# Altium schematic sheet ir_array.SchDoc
size A4; SheetNumber: 4; SheetTotal: 8
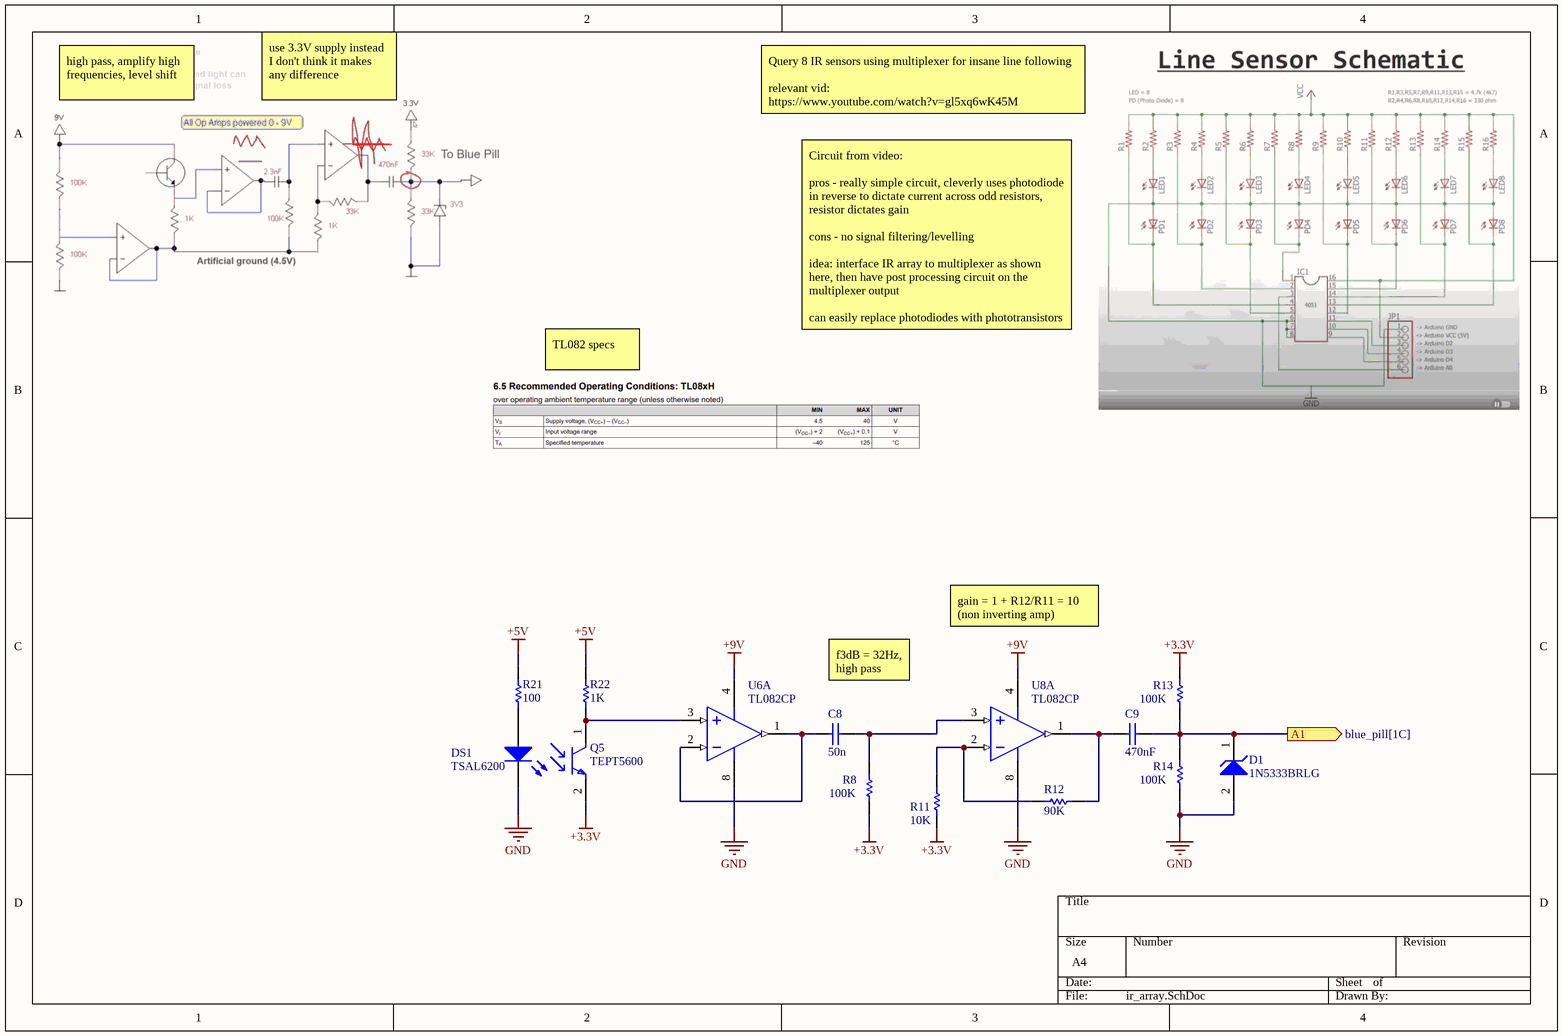
[diagram p0: ir_array.SchDoc]

## Parts
C8  value 50n  (hidden comment: Capacitor)
C9  value 470nF  (hidden comment: Capacitor)
D1  1N5333BRLG  [ONSC-SURMETIC40-2-017AA-01]
DS1  TSAL6200  [VISH-TSAL6200]
Q5  TEPT5600  [FP-6_544-5185_03-4-MFG]
R8  value 100K  (hidden comment: Resistor)
R11  value 10K  (hidden comment: Resistor)
R12  value 90K  (hidden comment: Resistor)
R13  value 100K  (hidden comment: Resistor)
R14  value 100K  (hidden comment: Resistor)
R21  value 100  (hidden comment: Resistor)
R22  value 1K  (hidden comment: Resistor)
U6  TL082CP  [P0008A]  (part A of 2)
U8  TL082CP  [P0008A]  (part A of 2)

## Ports
A1 (out, see blue_pill[1C])

## Nets
+3.3V: Q5.2(E) R8.2 R11.2 R13.1
+5V: R21.1 R22.1
+9V: U6.4(VCC-) U8.4(VCC-)
GND: D1.2(A) DS1.2(K) R14.2 U6.8(VCC+) U8.8(VCC+)
A1: C9.2 D1.1(K) R13.2 R14.1 ; port A1
NetC8_1: C8.1 U6.1(OUT1) U6.2(IN1-)
NetC8_2: C8.2 R8.1 U8.3(IN1+)
NetC9_1: C9.1 R12.1 U8.1(OUT1)
NetDS1_1: DS1.1(A) R21.2
NetQ5_1: Q5.1(C) R22.2 U6.3(IN1+)
NetR11_1: R11.1 R12.2 U8.2(IN1-)

## Notes on the sheet
- high pass, amplify high frequencies, level shift
- use 3.3V supply instead I don't think it makes any difference
- Query 8 IR sensors using multiplexer for insane line following
  relevant vid: https://www.youtube.com/watch?v=gl5xq6wK45M
- TL082 specs
- Circuit from video:
  pros - really simple circuit, cleverly uses photodiode in reverse to dictate current across odd resistors, resistor dictates gain
  cons - no signal filtering/levelling
  idea: interface IR array to multiplexer as shown here, then have post processing circuit on the multiplexer output
  can easily replace photodiodes with phototransistors
- gain = 1 + R12/R11 = 10
  (non inverting amp)
- f3dB = 32Hz, high pass

## Library data of the parts
C8 C9 = Capacitor: SimulationGenericComponent: True
D1 = CMP-1060-01301-1: 5 W Zener Voltage Regulator, 2-Pin Surmetic(TM) 40, Pb-Free, Tape and Reel; Manufacturer: On Semiconductor; VZ Typ (V): 3.3; P Max (W): 5; DatasheetVersion: Rev. 14; PackageVersion: Rev. O, 09/2005; Mounting Technology: Through Hole; ComponentLink2URL: http://www.onsemi.cn/pub_link/Collateral/1N5333B-D.PDF; Packing: Tape and Reel; PartNumber: 1N5333BRLG; PackageDescription: 2-Pin, Axial Lead, Diameter 3.49 mm; RoHS: Pb-Free; ComponentLink3Description: Package Specification; PackageReference: SURMETIC40-2-017AA-01; ComponentLink1Description: Manufacturer URL; ComponentLink3URL: http://www.onsemi.cn/pub_link/Collateral/017AA.PDF; ComponentLink1URL: http://www.onsemi.com/; ComponentLink2Description: Datasheet
DS1 = CMP-2000-07327-1: High Power Infrared Emitting Diode, GaAlAs, MQW, 1.35 V, 100 mA, -40 to 85 degC, 2-Pin THD, RoHS, Bulk; Manufacturer: Vishay; Lum Intensity: 500mW/srmcd; Product Depth (mm): 5.8mm; Type: IrLED; Luminous Intensity: 500mW/sr; Forward Voltage: 3V; Shape Type: Circular; Peak Wavelength: 950nm; Rad Hardened: No; Product Height (mm): 8.7mm; Number of  Elements: 1; Forward Current: 100mA; High Brightness: Yes; Reverse Voltage: 5V; DELETED: Compliant; Power Dissipation: 160W; Viewing Angle: 34deg; Lens Type: Colored; Packaging: Bulk; Lens Dimensions: 5x5x7.7mm; Package Reference: TSAL6200; Chip Material: GaAlAs; Package Description: 2-Pin Through Hole Device, Dia 5.8 mm, Pitch 2.54 mm; Main Category: IrLED; Manufacturer URL: http://www.vishay.com/; Product Length (mm): 5.8mm; Datasheet URL: http://www.vishay.com/docs/81010/tsal6200.pdf; Operating Temperature Classification: Industrial; Package Type: T-13/4; Pin Count: 2; Mounting: ThroughHole; Mounting Technology: ThroughHole; Test Current (It): 100mA; Datasheet Version: Rev. 2.4, 03/2014; Operating Temp Range: -40Cto85C
Q5 = CMP-02533-000004-1: SENSOR PHOTO 570NM TOP VIEW RAD; Number of Channels: 1; Collector Emitter Voltage (VCEO): 6V; Output Type: Analog; Power Consumption: 100mW; Max Collector Current: 20mA; Lens Style: Domed; Polarity: NPN; Dark Current: 50nA; Viewing Angle: 20°; Operating Supply Voltage: 5V; Package Material: SILICON; Wavelength: 570nm; Width: 5.75mm; Power Dissipation: 100mW; Package Quantity: 4000; Radiation Hardening: No; RoHS Compliant: Yes; Lead Free: Lead Free; Max Power Dissipation: 100mW; Max Operating Temperature: 85°C; Length: 5.75mm; Case/Package: Radial; Number of Elements: 1; Number of Pins: 2; Min Operating Temperature: -40°C; Mount: Through Hole; Height: 8mm; Orientation: Top View; Series: -; Collector Emitter Breakdown Voltage: 6V; Packaging: Bulk
R8 R11-R14 R21 R22 = Resistor: TC1: 0; SimulationGenericComponent: True; TC2: 0
U6 U8 = CMP-0055-00158-5: JFET-Input Operational Amplifier, 7 to 36 V, 0 to 70 degC, 8-pin DIP (P8), Pb-Free (RoHS); Manufacturer: Texas Instruments; Total Supply Voltage(Max)(+5V is 5, +/-5V is 10): 36; Rating: Catalog; Number of Channels: 2; Slew Rate(Typ)(V/us): 13; CMRR(Min)(dB): 70; Sub Family: General Purpose Amplifier, High Supply Voltage Amplifier (>=30V); Offset Drift(Typ)(uV/C): 18; Total Supply Voltage(Min)(+5V is 5, +/-5V is 10): 7; IIB(Max)(pA): 400; GBW(Typ)(MHz): 3; Iq per channel(Max)(mA): 2.8; Vio (25C)(Max)(mV): 15; PackageDescription: 8-Pin Plastic In-Line, Body 9.59 x 6.35 mm, Pitch 2.54 mm; ComponentLink2URL: http://www.ti.com/lit/ds/symlink/tl082.pdf; Mounting Technology: Through Hole; Code_JEDEC: MS-001; ComponentLink1Description: Manufacturer URL; ComponentLink3Description: Package Specification; PartNumber: TL082CP; PackageVersion: 4040082/E, 04/2010; Eco-Plan: Pb-Free (RoHS); ComponentLink1URL: http://www.ti.com/; PackageReference: P0008A; ComponentLink3URL: http://www.ti.com/litv/pdf/mpdi001b; DatasheetVersion: SLOS081G; ComponentLink2Description: Datasheet; Vn at 1kHz(Typ)(nV/rtHz): 18